# Altium schematic sheet RAM.SchDoc
size A3; PageSetup: Record=PageOptions|CenterHorizontal=True|CenterVertical=True|PrintScale=0.73|XCorrection=1.00|YCorrection=1.00|PrintKind=0|BorderSize=5000000|LeftOffset=0|BottomOffset=0|Orientation=2|PaperLength=1000|PaperWidth=1000|Scale=100|PaperSource=7|PrintQuality=-3|MediaType=1|DitherType=10|PrintScaleMode=1|PaperKind=A4|PaperIndex=9
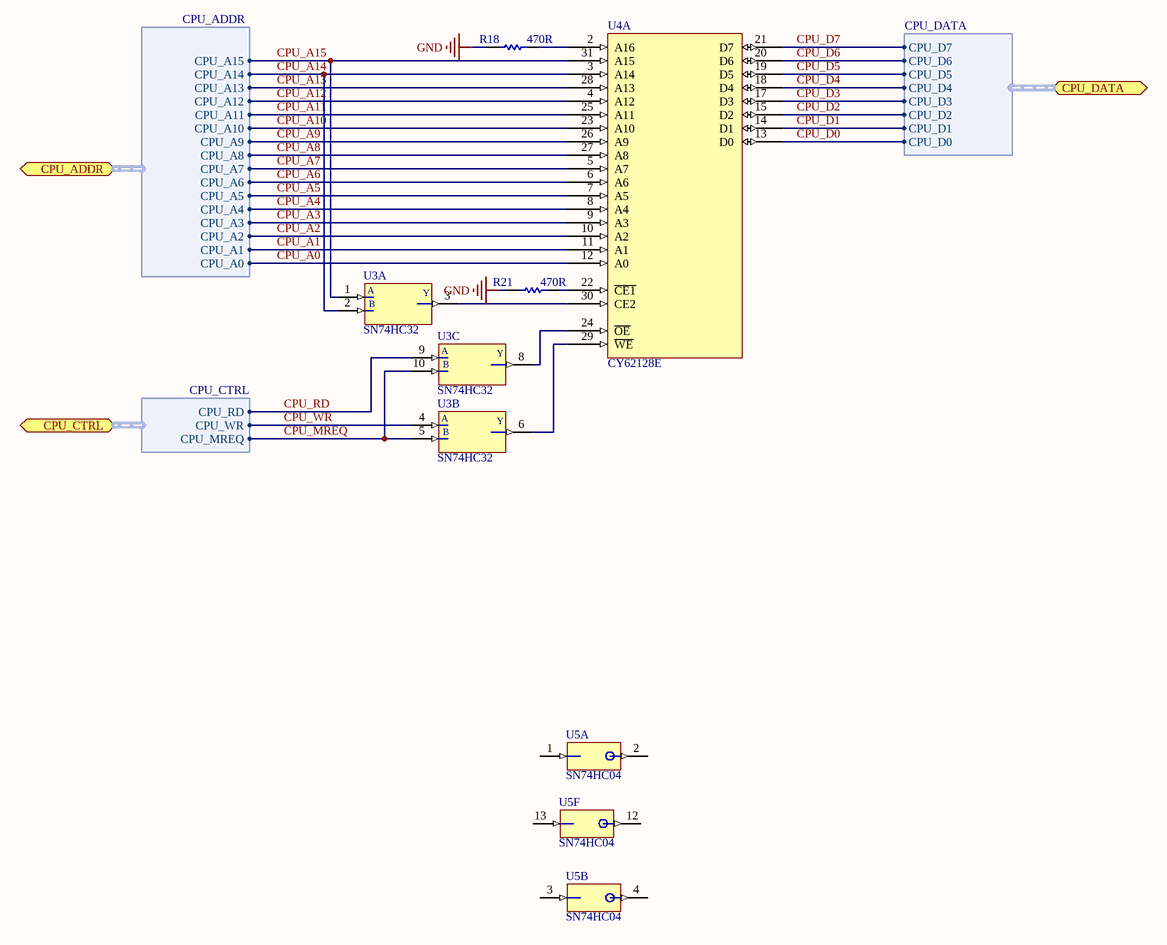
[diagram p0: RAM.SchDoc]

## Parts
R18  470R  [0805]
R21  470R  [0805]
U3  SN74HC32  [SOIC14]  (parts A,B,C of 5)
U4  CY62128E  [CY62128E-SOIC]  (part A of 2)
U5  SN74HC04  [SOIC14]  (parts A,B,F of 7)

## Ports
CPU_ADDR (harness CPU_ADDR), CPU_CTRL (harness CPU_CTRL), CPU_DATA (harness CPU_DATA)

## Harnesses
CPU_ADDR: CPU_A0, CPU_A1, CPU_A2, CPU_A3, CPU_A4, CPU_A5, CPU_A6, CPU_A7, CPU_A8, CPU_A9, CPU_A10, CPU_A11, CPU_A12, CPU_A13, CPU_A14, CPU_A15
CPU_CTRL: CPU_MREQ, CPU_RD, CPU_WR
CPU_DATA: CPU_D0, CPU_D1, CPU_D2, CPU_D3, CPU_D4, CPU_D5, CPU_D6, CPU_D7

## Nets
GND: R18.2 R21.2
CPU_A0: U4.12(A0) ; port CPU_ADDR.CPU_A0
CPU_A1: U4.11(A1) ; port CPU_ADDR.CPU_A1
CPU_A2: U4.10(A2) ; port CPU_ADDR.CPU_A2
CPU_A3: U4.9(A3) ; port CPU_ADDR.CPU_A3
CPU_A4: U4.8(A4) ; port CPU_ADDR.CPU_A4
CPU_A5: U4.7(A5) ; port CPU_ADDR.CPU_A5
CPU_A6: U4.6(A6) ; port CPU_ADDR.CPU_A6
CPU_A7: U4.5(A7) ; port CPU_ADDR.CPU_A7
CPU_A8: U4.27(A8) ; port CPU_ADDR.CPU_A8
CPU_A9: U4.26(A9) ; port CPU_ADDR.CPU_A9
CPU_A10: U4.23(A10) ; port CPU_ADDR.CPU_A10
CPU_A11: U4.25(A11) ; port CPU_ADDR.CPU_A11
CPU_A12: U4.4(A12) ; port CPU_ADDR.CPU_A12
CPU_A13: U4.28(A13) ; port CPU_ADDR.CPU_A13
CPU_A14: U3.2(B) U4.3(A14) ; port CPU_ADDR.CPU_A14
CPU_A15: U3.1(A) U4.31(A15) ; port CPU_ADDR.CPU_A15
CPU_D0: U4.13(D0) ; port CPU_DATA.CPU_D0
CPU_D1: U4.14(D1) ; port CPU_DATA.CPU_D1
CPU_D2: U4.15(D2) ; port CPU_DATA.CPU_D2
CPU_D3: U4.17(D3) ; port CPU_DATA.CPU_D3
CPU_D4: U4.18(D4) ; port CPU_DATA.CPU_D4
CPU_D5: U4.19(D5) ; port CPU_DATA.CPU_D5
CPU_D6: U4.20(D6) ; port CPU_DATA.CPU_D6
CPU_D7: U4.21(D7) ; port CPU_DATA.CPU_D7
CPU_MREQ: U3.5(B) U3.10(B) ; port CPU_CTRL.CPU_MREQ
CPU_RD: U3.9(A) ; port CPU_CTRL.CPU_RD
CPU_WR: U3.4(A) ; port CPU_CTRL.CPU_WR
NetR18_1: R18.1 U4.2(A16)
NetR21_1: R21.1 U4.22(~{CE1})
NetU3_3: U3.3(Y) U4.30(CE2)
NetU3_6: U3.6(Y) U4.29(~{WE})
NetU3_8: U3.8(Y) U4.24(~{OE})

Not connected (* = marked no-connect by the designer): U5 1(A) 2(Y) 3(A) 4(Y) 12(Y) 13(A)

## Library data of the parts
R18 R21 = Resistor
U3 = SN74HC32: Quadruple 2-Input Positive-OR Gates
U4 = CY62128E: 128KB Static RAM
U5 = SN74HC04: Hex Inverters